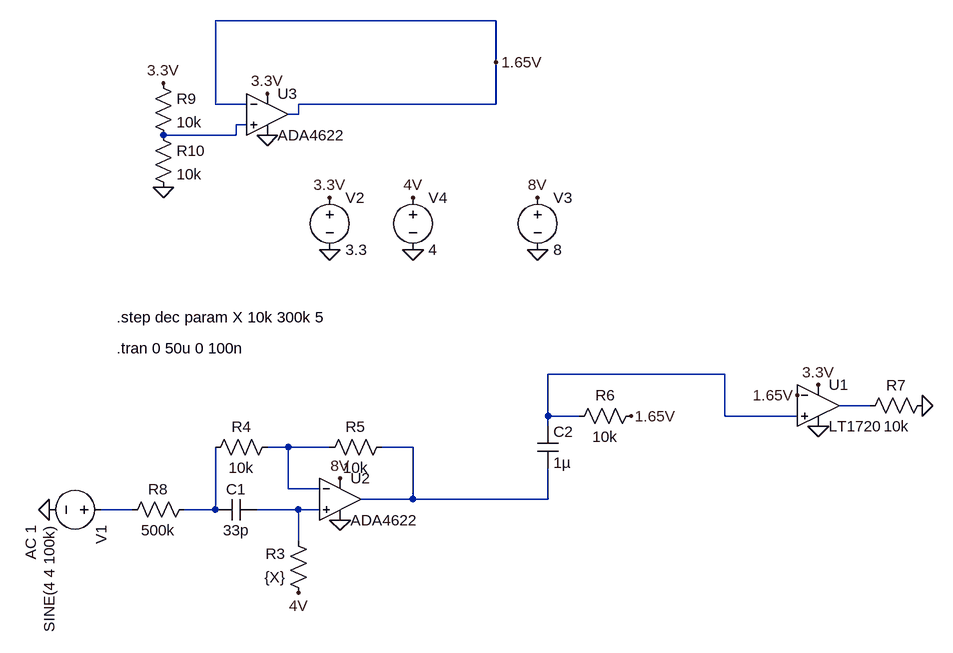
[diagram p0: schematic all_pass.asc]
all_pass.asc, the LTspice schematic file:
Version 4
SHEET 1 1220 680
WIRE 544 -464 112 -464
WIRE 544 -400 544 -464
WIRE 112 -336 112 -464
WIRE 160 -336 112 -336
WIRE 544 -336 544 -400
WIRE 544 -336 240 -336
WIRE 240 -320 240 -336
WIRE 240 -320 224 -320
WIRE 160 -304 144 -304
WIRE 144 -288 144 -304
WIRE 144 -288 32 -288
WIRE 896 80 624 80
WIRE 1120 128 1072 128
WIRE 624 144 624 80
WIRE 672 144 624 144
WIRE 896 144 896 80
WIRE 1008 144 896 144
WIRE 624 160 624 144
WIRE 224 192 192 192
WIRE 288 192 224 192
WIRE 416 192 368 192
WIRE 224 256 224 192
WIRE 272 256 224 256
WIRE 416 272 416 192
WIRE 416 272 336 272
WIRE 624 272 624 224
WIRE 624 272 416 272
WIRE -16 288 -64 288
WIRE 112 288 112 192
WIRE 112 288 64 288
WIRE 240 288 176 288
WIRE 272 288 240 288
WIRE 240 336 240 288
FLAG -144 288 0
FLAG 304 304 0
FLAG 608 -112 0
FLAG 608 -192 8V
FLAG 304 240 8V
FLAG 416 -112 0
FLAG 416 -192 4V
FLAG 240 416 4V
FLAG 288 -112 0
FLAG 288 -192 3.3V
FLAG 32 -208 0
FLAG 32 -368 3.3V
FLAG 752 144 1.65V
FLAG 1008 112 1.65V
FLAG 1040 96 3.3V
FLAG 1040 160 0
FLAG 1200 128 0
FLAG 192 -352 3.3V
FLAG 192 -288 0
FLAG 544 -400 1.65V
SYMBOL voltage -48 288 R90
WINDOW 123 24 124 Left 2
WINDOW 39 0 0 Left 0
SYMATTR Value2 AC 1
SYMATTR InstName V1
SYMATTR Value SINE(4 4 100k)
SYMBOL cap 176 272 R90
WINDOW 0 0 32 VBottom 2
WINDOW 3 32 32 VTop 2
SYMATTR InstName C1
SYMATTR Value 33p
SYMBOL res 256 432 R180
WINDOW 0 36 76 Left 2
WINDOW 3 36 40 Left 2
SYMATTR InstName R3
SYMATTR Value {X}
SYMBOL res 96 208 R270
WINDOW 0 32 56 VTop 2
WINDOW 3 0 56 VBottom 2
SYMATTR InstName R4
SYMATTR Value 10k
SYMBOL res 272 208 R270
WINDOW 0 32 56 VTop 2
WINDOW 3 0 56 VBottom 2
SYMATTR InstName R5
SYMATTR Value 10k
SYMBOL voltage 608 -208 R0
WINDOW 123 0 0 Left 0
WINDOW 39 0 0 Left 0
SYMATTR InstName V3
SYMATTR Value 8
SYMBOL voltage 416 -208 R0
WINDOW 123 0 0 Left 0
WINDOW 39 0 0 Left 0
SYMATTR InstName V4
SYMATTR Value 4
SYMBOL Opamps\\ADA4622 304 208 R0
SYMATTR InstName U2
SYMBOL cap 608 160 R0
SYMATTR InstName C2
SYMATTR Value 1µ
SYMBOL res 768 128 R90
WINDOW 0 0 56 VBottom 2
WINDOW 3 32 56 VTop 2
SYMATTR InstName R6
SYMATTR Value 10k
SYMBOL voltage 288 -208 R0
WINDOW 123 0 0 Left 0
WINDOW 39 0 0 Left 0
SYMATTR InstName V2
SYMATTR Value 3.3
SYMBOL res 16 -384 R0
SYMATTR InstName R9
SYMATTR Value 10k
SYMBOL res 16 -304 R0
SYMATTR InstName R10
SYMATTR Value 10k
SYMBOL Comparators\\LT1720 1040 64 R0
SYMATTR InstName U1
SYMBOL res 1216 112 R90
WINDOW 0 0 56 VBottom 2
WINDOW 3 32 56 VTop 2
SYMATTR InstName R7
SYMATTR Value 10k
SYMBOL Opamps\\ADA4622 192 -384 R0
SYMATTR InstName U3
SYMBOL res 80 272 R90
WINDOW 0 0 56 VBottom 2
WINDOW 3 32 56 VTop 2
SYMATTR InstName R8
SYMATTR Value 500k
TEXT -40 40 Left 2 !.tran 0 50u 0 100n
TEXT -40 -8 Left 2 !.step dec param X 10k 300k 5

The netlist it stands for:
* all_pass.asc
V1 N006 0 SINE(4 4 100k) AC 1
C1 N008 N007 33p
R3 4V N008 {X}
R4 N007 N004 10k
R5 N004 N005 10k
V3 8V 0 8
V4 4V 0 4
XU2 N008 N004 8V 0 N005 ADA4622  ; pins In+ In- V+ V- OUT
C2 N002 N005 1µ
R6 1.65V N002 10k
V2 3.3V 0 3.3
R9 3.3V N001 10k
R10 N001 0 10k
XU1 N002 1.65V 3.3V 0 N003 LT1720  ; pins In+ In- V+ V- OUT
R7 0 N003 10k
XU3 N001 1.65V 3.3V 0 1.65V ADA4622  ; pins In+ In- V+ V- OUT
R8 N007 N006 500k
.tran 0 50u 0 100n
.step dec param X 10k 300k 5
.lib ADA4622.lib
.lib LT1720.sub
.backanno
.end